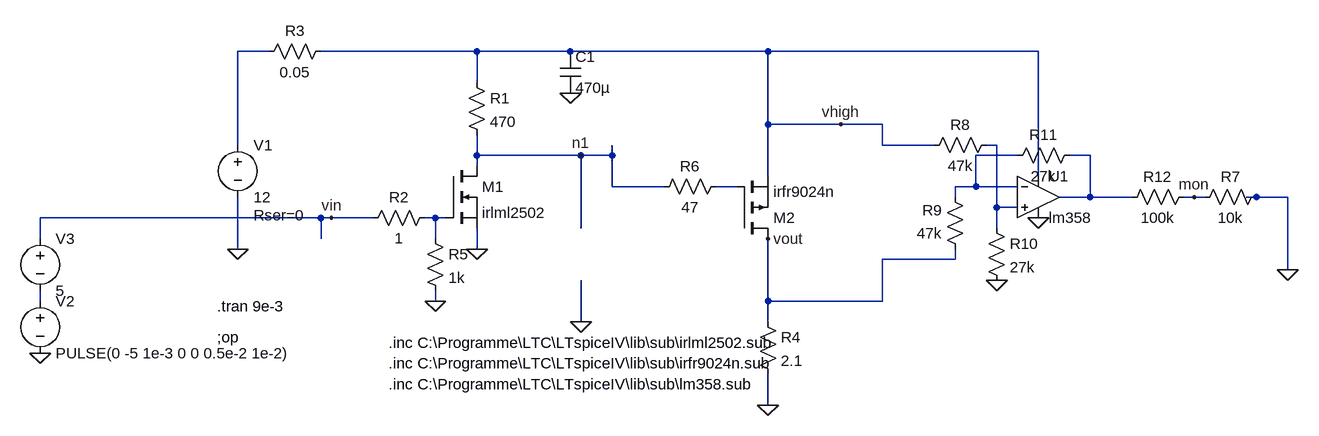
[diagram p0: schematic modell_pwm_drv.asc]
modell_pwm_drv.asc, the LTspice schematic file:
Version 4
SHEET 1 1564 680
WIRE -80 -48 -128 -48
WIRE 240 -48 0 -48
WIRE 384 -48 240 -48
WIRE 688 -48 384 -48
WIRE 1104 -48 688 -48
WIRE 240 0 240 -48
WIRE 688 64 688 -48
WIRE 800 64 688 64
WIRE 864 64 800 64
WIRE -128 96 -128 -48
WIRE 864 96 864 64
WIRE 944 96 864 96
WIRE 1040 96 1024 96
WIRE 240 112 240 80
WIRE 400 112 240 112
WIRE 448 112 448 96
WIRE 448 112 400 112
WIRE 1072 112 1008 112
WIRE 1184 112 1152 112
WIRE 240 128 240 112
WIRE 688 144 688 64
WIRE 1104 144 1104 -48
WIRE 448 160 448 112
WIRE 528 160 448 160
WIRE 640 160 608 160
WIRE 1008 160 1008 112
WIRE 1008 160 976 160
WIRE 1072 160 1008 160
WIRE 976 176 976 160
WIRE 1184 176 1184 112
WIRE 1184 176 1136 176
WIRE 1248 176 1184 176
WIRE 1344 176 1328 176
WIRE 1360 176 1344 176
WIRE 1440 176 1424 176
WIRE 1488 176 1440 176
WIRE 1040 192 1040 96
WIRE 1072 192 1040 192
WIRE 0 208 -432 208
WIRE 16 208 0 208
WIRE 80 208 16 208
WIRE 176 208 160 208
WIRE 192 208 176 208
WIRE 400 224 400 112
WIRE 1040 224 1040 192
WIRE -432 240 -432 208
WIRE 0 240 0 208
WIRE 176 240 176 208
WIRE -128 256 -128 176
WIRE 240 256 240 224
WIRE 976 272 976 256
WIRE 976 272 864 272
WIRE 1488 288 1488 176
WIRE -432 336 -432 320
WIRE 176 336 176 320
WIRE 688 336 688 240
WIRE 864 336 864 272
WIRE 864 336 688 336
WIRE 400 368 400 304
WIRE 688 368 688 336
WIRE 688 496 688 448
FLAG 240 256 0
FLAG -128 256 0
FLAG 400 112 n1
FLAG 400 368 0
FLAG 688 496 0
FLAG 176 336 0
FLAG 16 208 vin
FLAG 688 240 vout
FLAG -432 416 0
FLAG 384 16 0
FLAG 800 64 vhigh
FLAG 1104 208 0
FLAG 1040 304 0
FLAG 1488 288 0
FLAG 1344 176 mon
SYMBOL nmos 192 128 R0
SYMATTR InstName M1
SYMATTR Value irlml2502
SYMATTR Prefix X
SYMBOL res 224 -16 R0
SYMATTR InstName R1
SYMATTR Value 470
SYMBOL voltage -128 80 R0
WINDOW 123 0 0 Left 2
WINDOW 39 24 124 Left 2
SYMATTR SpiceLine Rser=0
SYMATTR InstName V1
SYMATTR Value 12
SYMBOL res 176 192 R90
WINDOW 0 0 56 VBottom 2
WINDOW 3 32 56 VTop 2
SYMATTR InstName R2
SYMATTR Value 1
SYMBOL voltage -432 320 R0
WINDOW 123 0 0 Left 2
WINDOW 39 0 0 Left 2
SYMATTR InstName V2
SYMATTR Value PULSE(0 -5 1e-3 0 0 0.5e-2 1e-2)
SYMBOL res 672 352 R0
SYMATTR InstName R4
SYMATTR Value 2.1
SYMBOL pmos 640 240 M180
SYMATTR InstName M2
SYMATTR Value irfr9024n
SYMATTR Prefix X
SYMBOL res 160 224 R0
SYMATTR InstName R5
SYMATTR Value 1k
SYMBOL res 624 144 R90
WINDOW 0 0 56 VBottom 2
WINDOW 3 32 56 VTop 2
SYMATTR InstName R6
SYMATTR Value 47
SYMBOL voltage -432 224 R0
WINDOW 123 0 0 Left 2
WINDOW 39 0 0 Left 2
SYMATTR InstName V3
SYMATTR Value 5
SYMBOL cap 368 -48 R0
SYMATTR InstName C1
SYMATTR Value 470µ
SYMBOL res 16 -64 R90
WINDOW 0 0 56 VBottom 2
WINDOW 3 32 56 VTop 2
SYMATTR InstName R3
SYMATTR Value 0.05
SYMBOL Opamps\\opamp2 1104 112 R0
SYMATTR InstName U1
SYMATTR Value lm358
SYMBOL res 1040 80 R90
WINDOW 0 0 56 VBottom 2
WINDOW 3 32 56 VTop 2
SYMATTR InstName R8
SYMATTR Value 47k
SYMBOL res 992 272 R180
WINDOW 0 36 76 Left 2
WINDOW 3 36 40 Left 2
SYMATTR InstName R9
SYMATTR Value 47k
SYMBOL res 1024 208 R0
SYMATTR InstName R10
SYMATTR Value 27k
SYMBOL res 1168 96 R90
WINDOW 0 0 56 VBottom 2
WINDOW 3 32 56 VTop 2
SYMATTR InstName R11
SYMATTR Value 27k
SYMBOL res 1344 160 R90
WINDOW 0 0 56 VBottom 2
WINDOW 3 32 56 VTop 2
SYMATTR InstName R12
SYMATTR Value 100k
SYMBOL res 1456 160 R90
WINDOW 0 0 56 VBottom 2
WINDOW 3 32 56 VTop 2
SYMATTR InstName R7
SYMATTR Value 10k
TEXT 104 400 Left 2 !.inc C:\\Programme\\LTC\\LTspiceIV\\lib\\sub\\irlml2502.sub
TEXT 104 432 Left 2 !.inc C:\\Programme\\LTC\\LTspiceIV\\lib\\sub\\irfr9024n.sub
TEXT -160 392 Left 2 !;op
TEXT 104 464 Left 2 !.inc C:\\Programme\\LTC\\LTspiceIV\\lib\\sub\\lm358.sub
TEXT -160 344 Left 2 !.tran 9e-3

The netlist it stands for:
* modell_pwm_drv.asc
XM1 n1 N006 0 irlml2502  ; pins D G S
R1 vhigh n1 470
V1 N001 0 12 Rser=0
R2 N006 vin 1
V2 N007 0 PULSE(0 -5 1e-3 0 0 0.5e-2 1e-2)
R4 vout 0 2.1
XM2 vout N005 vhigh irfr9024n  ; pins D G S
R5 N006 0 1k
R6 N005 n1 47
V3 vin N007 5
C1 vhigh 0 470µ
R3 vhigh N001 0.05
XU1 N002 N003 vhigh 0 N004 lm358  ; pins In+ In- V+ V- OUT
R8 N002 vhigh 47k
R9 vout N003 47k
R10 N002 0 27k
R11 N004 N003 27k
R12 mon N004 100k
R7 0 mon 10k
.inc C:\Programme\LTC\LTspiceIV\lib\sub\irlml2502.sub
.inc C:\Programme\LTC\LTspiceIV\lib\sub\irfr9024n.sub
;op
.inc C:\Programme\LTC\LTspiceIV\lib\sub\lm358.sub
.tran 9e-3
.backanno
.end